# EAGLE schematic attiny_bo (EAGLE 6.2)
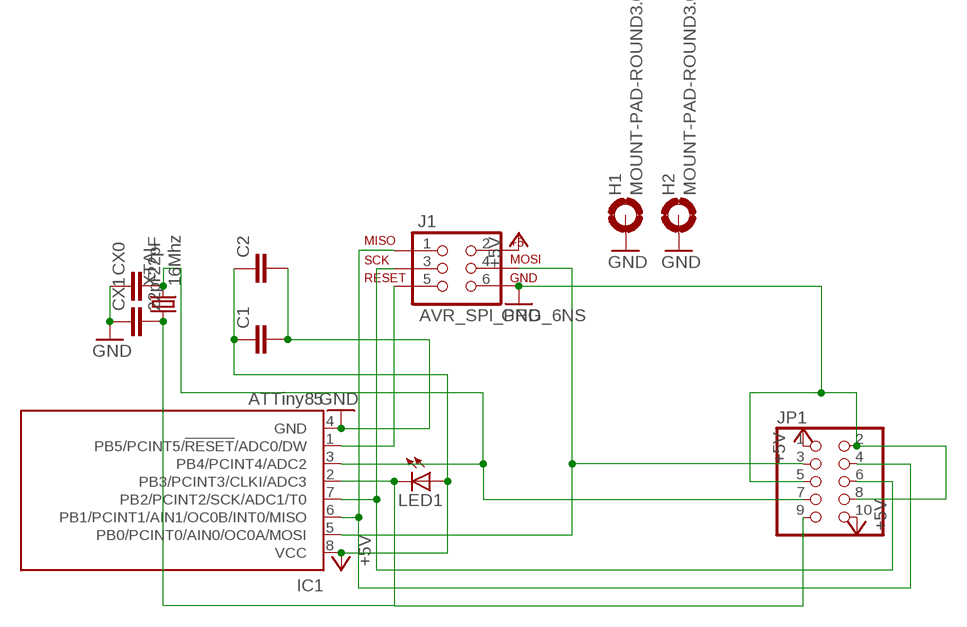
[diagram p0: schematic, sheet 1]

## Parts
C1  C-EUC0805  [C0805]
C2  C-EUC0805  [C0805]
CX0  22pF  C-EUC0603  [C0603]
CX1  22pF  C-EUC0603  [C0603]
H1  MOUNT-PAD-ROUND3.0  [3,0-PAD]
H2  MOUNT-PAD-ROUND3.0  [3,0-PAD]
IC1  ATTiny85  TINY13-20SU  [8S2]
J1  AVR_SPI_PRG_6NS  [2X3-NS]
JP1  PINHD-2X5  [2X05]
LED1  LED0603  [LED-0603]
XTAL  16Mhz  CRYSTALCTS406  [CTS406]

## Nets
+5V [POWER]: C1.1 C2.1 IC1.8(VCC) J1.2 JP1.1 JP1.10 LED1.A
GND [POWER]: C1.2 C2.2 CX0.1 CX1.1 H1.B3,0(MOUNT) H2.B3,0(MOUNT) IC1.4(GND) J1.6 JP1.2 JP1.5 JP1.8
PB0: IC1.5(PB0/PCINT0/AIN0/OC0A/MOSI) J1.4 JP1.3
PB1: IC1.6(PB1/PCINT1/AIN1/OC0B/INT0/MISO) J1.1 JP1.4
PB2: IC1.7(PB2/PCINT2/SCK/ADC1/T0) J1.3 JP1.6
PB3: CX1.2 IC1.2(PB3/PCINT3/CLKI/ADC3) JP1.9 LED1.C XTAL.1
PB4: CX0.2 IC1.3(PB4/PCINT4/ADC2) JP1.7 XTAL.3
PB5: IC1.1(PB5/PCINT5/!RESET!/ADC0/DW) J1.5

## Library data of the parts
C1 C2 CX0 CX1 = rcl:C-EU: CAPACITOR, European symbol
H1 H2 = holes:MOUNT-PAD-ROUND: MOUNTING PAD, round
IC1 = atmel:TINY13: 8-bit AVR Microcontroller with 1K Bytes In-System Programmable Flash Source: http://www.atmel.com/dyn/resources/prod_documents/2535S.pdf; MPN: ATTINY13-20SU; OC_FARNELL: 9171568; OC_NEWARK: 96K6522
J1 = SparkFun-Connectors:AVR_SPI_PRG_6: AVR ISP 6 Pin This is the reduced ISP connector for AVR programming. Common on Arduino. This footprint will take up less PCB space and can be used with a 10-pin to 6-pin adapter such as SKU: BOB-08508
JP1 = pinhead:PINHD-2X5: PIN HEADER
LED1 = SparkFun-LED:LED: LEDs Standard schematic elements and footprints for 5mm, 3mm, 1206, and 0603 sized LEDs. 5mm - Spark Fun Electronics SKU : COM-00529 (and others)
XTAL = crystal:CRYSTAL: CRYSTAL; OC_FARNELL: unknown; OC_NEWARK: unknown

## Net classes
1 POWER: width 0.254 mm